# Altium schematic sheet Ports.SchDoc
size 420 x 297 mm; SheetNumber: 13; SheetTotal: 13
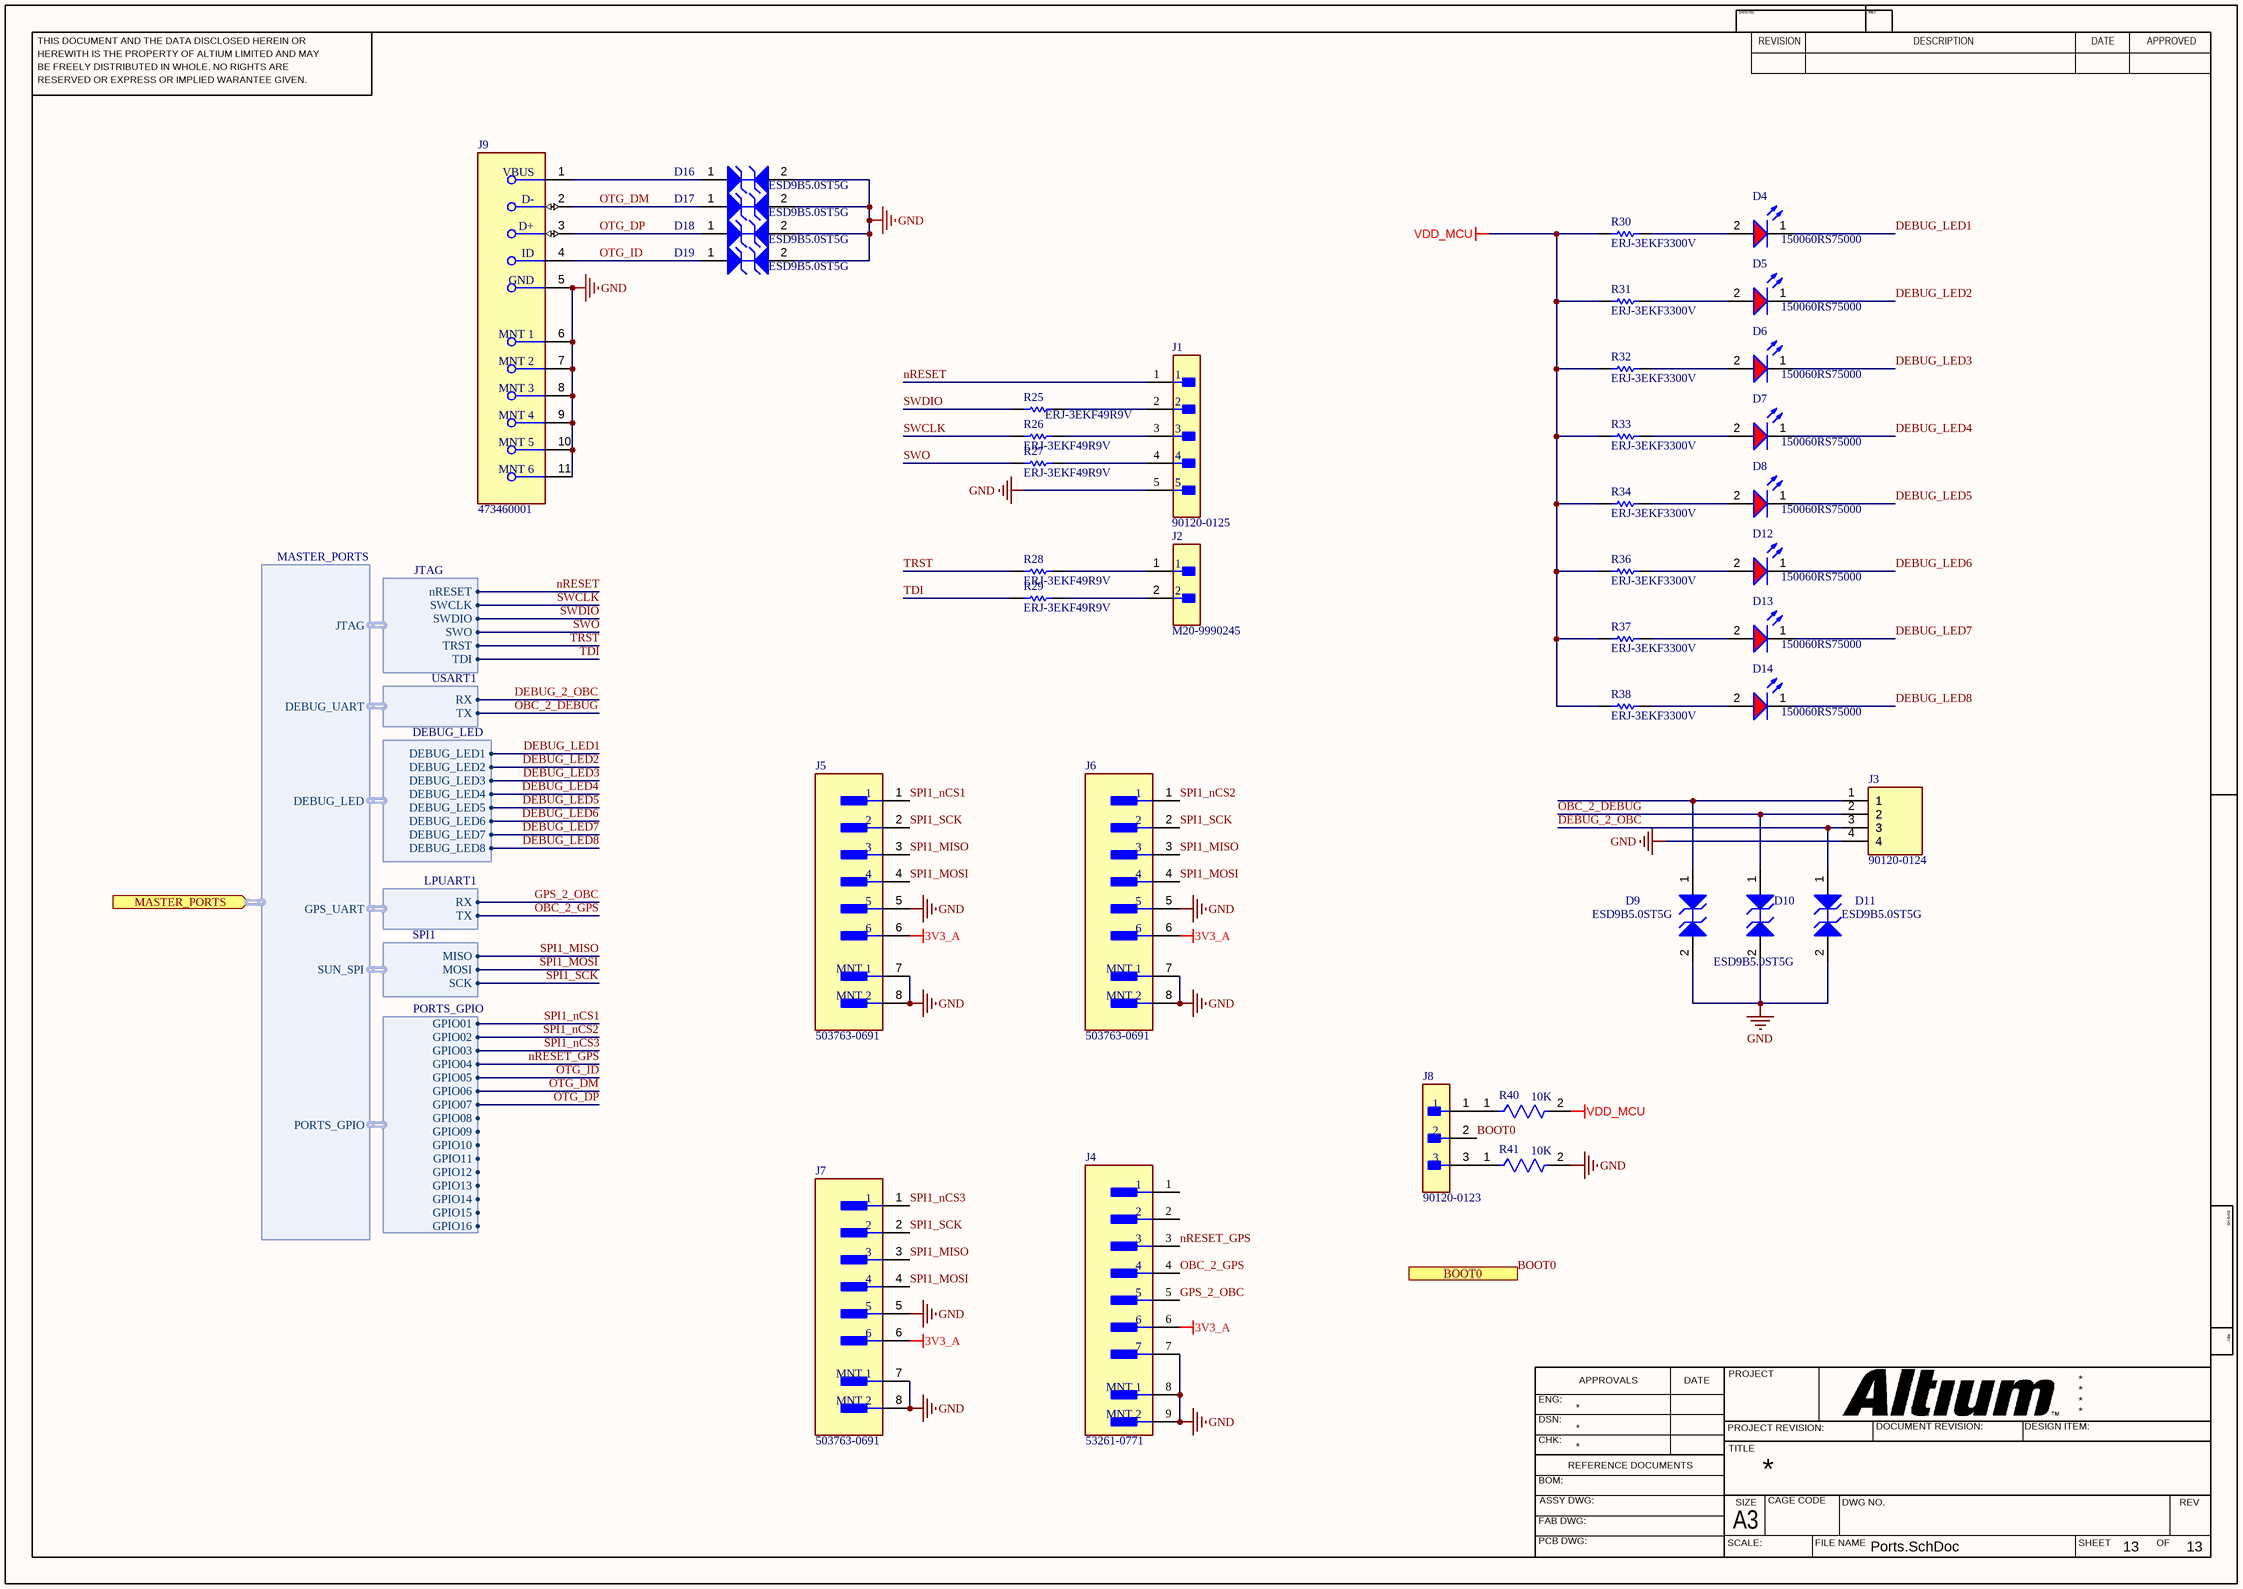
[diagram p0: Ports.SchDoc]

## Parts
D4  150060RS75000  [WL-SMCW_0603_150060xx75000]
D5  150060RS75000  [WL-SMCW_0603_150060xx75000]
D6  150060RS75000  [WL-SMCW_0603_150060xx75000]
D7  150060RS75000  [WL-SMCW_0603_150060xx75000]
D8  150060RS75000  [WL-SMCW_0603_150060xx75000]
D9  ESD9B5.0ST5G  [ONSC-SOD-923-2-514AB-01_V]
D10  ESD9B5.0ST5G  [ONSC-SOD-923-2-514AB-01_V]
D11  ESD9B5.0ST5G  [ONSC-SOD-923-2-514AB-01_V]
D12  150060RS75000  [WL-SMCW_0603_150060xx75000]
D13  150060RS75000  [WL-SMCW_0603_150060xx75000]
D14  150060RS75000  [WL-SMCW_0603_150060xx75000]
D16  ESD9B5.0ST5G  [ONSC-SOD-923-2-514AB-01_V]
D17  ESD9B5.0ST5G  [ONSC-SOD-923-2-514AB-01_V]
D18  ESD9B5.0ST5G  [ONSC-SOD-923-2-514AB-01_V]
D19  ESD9B5.0ST5G  [ONSC-SOD-923-2-514AB-01_V]
J1  90120-0125  [FP-90120-0125-MFG]
J2  M20-9990245  [FP-M20-9990245-MFG]
J3  90120-0124  [HDRV4W65P0X254_1X4_1016X254X945P]
J4  53261-0771  [FP-53261-0771-MFG]
J5  503763-0691  [FP-503763-0691-MFG]
J6  503763-0691  [FP-503763-0691-MFG]
J7  503763-0691  [FP-503763-0691-MFG]
J8  90120-0123  [FP-90120-0123-MFG]
J9  473460001  [FP-473460001-MFG]
R25  ERJ-3EKF49R9V  [RESC1608X55X30ML15T15]
R26  ERJ-3EKF49R9V  [RESC1608X55X30ML15T15]
R27  ERJ-3EKF49R9V  [RESC1608X55X30ML15T15]
R28  ERJ-3EKF49R9V  [RESC1608X55X30ML15T15]
R29  ERJ-3EKF49R9V  [RESC1608X55X30ML15T15]
R30  ERJ-3EKF3300V  [RESC1608X55X30LL15T15]
R31  ERJ-3EKF3300V  [RESC1608X55X30LL15T15]
R32  ERJ-3EKF3300V  [RESC1608X55X30LL15T15]
R33  ERJ-3EKF3300V  [RESC1608X55X30LL15T15]
R34  ERJ-3EKF3300V  [RESC1608X55X30LL15T15]
R36  ERJ-3EKF3300V  [RESC1608X55X30LL15T15]
R37  ERJ-3EKF3300V  [RESC1608X55X30LL15T15]
R38  ERJ-3EKF3300V  [RESC1608X55X30LL15T15]
R40  10K  [FP-RK73B1J-MFG]
R41  10K  [FP-RK73B1J-MFG]

## Ports
BOOT0 (in), MASTER_PORTS (in, harness MASTER_PORTS)

## Harnesses
MASTER_PORTS: JTAG, DEBUG_UART, DEBUG_LED, GPS_UART, SUN_SPI, PORTS_GPIO
JTAG: nRESET, SWCLK, SWDIO, SWO, TDI, TRST
USART1: TX, RX
DEBUG_LED: DEBUG_LED1, DEBUG_LED2, DEBUG_LED3, DEBUG_LED4, DEBUG_LED5, DEBUG_LED6, DEBUG_LED7, DEBUG_LED8
LPUART1: TX, RX
SPI1: MOSI, MISO, SCK
PORTS_GPIO: GPIO01, GPIO02, GPIO03, GPIO04, GPIO05, GPIO06, GPIO07, GPIO08, GPIO09, GPIO10, GPIO11, GPIO12, GPIO13, GPIO14, GPIO15, GPIO16

## Nets
3V3_A: J4.6 J5.6 J6.6 J7.6
GND: D9.2(A2) D10.2(A2) D11.2(A2) D16.2(A2) D17.2(A2) D18.2(A2) D19.2(A2) J1.5 J3.4 J4.7 J4.8(MNT_1) J4.9(MNT_2) J5.5 J5.7(MNT_1) J5.8(MNT_2) J6.5 J6.7(MNT_1) J6.8(MNT_2) J7.5 J7.7(MNT_1) J7.8(MNT_2) J9.5(GND) J9.6(MNT_1) J9.7(MNT_2) J9.8(MNT_3) J9.9(MNT_4) J9.10(MNT_5) J9.11(MNT_6) R41.2
VDD_MCU: R30.1 R31.1 R32.1 R33.1 R34.1 R36.1 R37.1 R38.1 R40.2
BOOT0: J8.2 ; port BOOT0
DEBUG_2_OBC: D11.1(A1) J3.3 ; harness USART1.RX
DEBUG_LED1: D4.1(K) ; harness DEBUG_LED.DEBUG_LED1
DEBUG_LED2: D5.1(K) ; harness DEBUG_LED.DEBUG_LED2
DEBUG_LED3: D6.1(K) ; harness DEBUG_LED.DEBUG_LED3
DEBUG_LED4: D7.1(K) ; harness DEBUG_LED.DEBUG_LED4
DEBUG_LED5: D8.1(K) ; harness DEBUG_LED.DEBUG_LED5
DEBUG_LED6: D12.1(K) ; harness DEBUG_LED.DEBUG_LED6
DEBUG_LED7: D13.1(K) ; harness DEBUG_LED.DEBUG_LED7
DEBUG_LED8: D14.1(K) ; harness DEBUG_LED.DEBUG_LED8
GPS_2_OBC: J4.5 ; harness LPUART1.RX
nRESET: J1.1 ; harness JTAG.nRESET
nRESET_GPS: J4.3 ; harness PORTS_GPIO.GPIO04
OBC_2_DEBUG: D10.1(A1) J3.2 ; harness USART1.TX
OBC_2_GPS: J4.4 ; harness LPUART1.TX
OTG_DM: D17.1(A1) J9.2(D-) ; harness PORTS_GPIO.GPIO06
OTG_DP: D18.1(A1) J9.3(D+) ; harness PORTS_GPIO.GPIO07
OTG_ID: D19.1(A1) J9.4(ID) ; harness PORTS_GPIO.GPIO05
SPI1_MISO: J5.3 J6.3 J7.3 ; harness SPI1.MISO
SPI1_MOSI: J5.4 J6.4 J7.4 ; harness SPI1.MOSI
SPI1_nCS1: J5.1 ; harness PORTS_GPIO.GPIO01
SPI1_nCS2: J6.1 ; harness PORTS_GPIO.GPIO02
SPI1_nCS3: J7.1 ; harness PORTS_GPIO.GPIO03
SPI1_SCK: J5.2 J6.2 J7.2 ; harness SPI1.SCK
SWCLK: R26.1 ; harness JTAG.SWCLK
SWDIO: R25.1 ; harness JTAG.SWDIO
SWO: R27.1 ; harness JTAG.SWO
TDI: R29.1 ; harness JTAG.TDI
TRST: R28.1 ; harness JTAG.TRST
NetD4_2: D4.2(A) R30.2
NetD5_2: D5.2(A) R31.2
NetD6_2: D6.2(A) R32.2
NetD7_2: D7.2(A) R33.2
NetD8_2: D8.2(A) R34.2
NetD9_1: D9.1(A1) J3.1
NetD12_2: D12.2(A) R36.2
NetD13_2: D13.2(A) R37.2
NetD14_2: D14.2(A) R38.2
NetD16_1: D16.1(A1) J9.1(VBUS)
NetJ1_2: J1.2 R25.2
NetJ1_3: J1.3 R26.2
NetJ1_4: J1.4 R27.2
NetJ2_1: J2.1 R28.2
NetJ2_2: J2.2 R29.2
NetJ8_1: J8.1 R40.1
NetJ8_3: J8.3 R41.1

Not connected (* = marked no-connect by the designer): J4 1 2

## Notes on the sheet
- THIS DOCUMENT AND THE DATA DISCLOSED HEREIN OR
- HEREWITH IS THE PROPERTY OF ALTIUM LIMITED AND MAY
- DWG NO:
- REVISION
- REV:
- DESCRIPTION
- DATE
- APPROVED
- BE FREELY DISTRIBUTED IN WHOLE. NO RIGHTS ARE
- RESERVED OR EXPRESS OR IMPLIED WARANTEE GIVEN.
- ENG:
- APPROVALS
- PROJECT
- DSN:
- CHK:
- REFERENCE DOCUMENTS
- PROJECT REVISION:
- TITLE
- DOCUMENT REVISION:
- DESIGN ITEM:
- BOM:
- FAB DWG:
- PCB DWG:
- ASSY DWG:
- SCALE:
- A3
- SIZE
- CAGE CODE
- FILE NAME
- DWG NO.
- SHEET
- OF
- REV

## Library data of the parts
D4-D8 D12-D14 = CMP-1426-00001-4: LED Low-Power Uni-Color Red 630nm 2V 2-Pin Chip 0603(1608Metric) T/R; Max Junction Temperature (Tj): 95°C; Dominant Wavelength: 625nm; Lens Style: Clear, Rectangular; Viewing Angle: 140°; Forward Current: 100mA; Max Reverse Voltage (DC): 5V; Luminous Intensity: 250mcd; Test Current: 20mA; Power Dissipation: 72mW; Max Operating Temperature: 85°C; Mount: Surface Mount; Height: 700µm; Packaging: Tape and Reel; REACH SVHC: Unknown; Case Code (Metric): 1608; Peak Wavelength: 630nm; Forward Voltage: 2V; Case/Package: 0603; Color: Red; RoHS: Compliant; Width: 800µm; Reverse Voltage: 5V; Min Operating Temperature: -40°C; Wavelength: 625nm; Case Code (Imperial): 0603; Length: 1.6mm
D9-D11 D16-D19 = CMP-1063-00119-1: Transient Voltage Suppressor, Micro-Packaged Diode for ESD Protection, 2-Pin SOD-923, Pb-Free, Tape and Reel; Manufacturer: On Semiconductor; Number of Lines: 1; Direction: Bidirectional; V(BR) Min (V): 5.8; VRWM Max (V): 5; Packing: Tape and Reel; PackageDescription: 2-Pin SOD, Body 0.8 x 0.6 mm; IR Max (uA): 1; ComponentLink3Description: Package Specification; PartNumber: ESD9B5.0ST5G; ComponentLink1URL: http://www.onsemi.com/; RoHS: Pb-Free; Mounting Technology: Surface Mount; DatasheetVersion: Rev. 2; ComponentLink2URL: http://www.onsemi.cn/pub_link/Collateral/ESD9B-D.PDF; ComponentLink3URL: http://www.onsemi.com/pub_link/Collateral/514AB.PDF; PackageReference: SOD-923-2-514AB-01; PackageVersion: Rev. C, 03/2011; ComponentLink1Description: Manufacturer URL; ComponentLink2Description: Datasheet
J1 = CMP-00257-00655425-1: 90120-0125 2.54mm Pitch C-Grid III Header, Single Row, Vertical, 5 Circuits, Tin (Sn) Plating; NexarPartId: 655425; Manufacturer Lifecycle Status: ACTIVE; Lead Length: 2.9mm; Number of Positions: 5; Current Rating: 3A; Mating Post Length: 6.75mm; Glow Wire Compliant: Non-compliant; Contact Resistance: 20mΩ; Voltage Rating: 350V; Gender: Male; Max Voltage Rating (DC): 350.35kV; Max Operating Temperature: 125°C; Number of Pins: 5; Plating: Tin; Contact Material: Brass; Mount: Through Hole; Contact Gender: Male; Packaging: Bulk; Schedule B: 8536694040; Lifecycle Status: Production; Lead Pitch: 2.54mm; Radiation Hardening: No; Orientation: Vertical; Min Operating Temperature: -55°C; Country of Origin: SK; Housing Color: Black; REACH SVHC: No SVHC; Contact Plating: Tin; Number of Rows: 1; Number of Circuits: 5; Termination: Solder; Number of Contacts: 5; Pitch: 2.54mm; Housing Material: Polyester; RoHS: Compliant; Lead Free: Lead Free; Voltage Rating (AC): 350V
J2 = CMP-15831-000105-1: CONN HEADER VERT 2POS 2.54MM; Working Voltage: 750V; Gender: Male; Number of Poles: 2; Current Rating: 3A; Mated Stacking Heights: 16.54mm; Contact Resistance: 25mR; Connector Type: Male Pin; Insulation Resistance: 10GR; Mating Cycles: 300; Voltage: 50V; Flammability Rating: UL94 V-0; Pitch: 2.54mm; Series: M20; Number of Contacts: 2; Height: 0.12inch; Min Operating Temperature: -40°C; Contact Finish - Mating: GOLD; Number of Positions: 2; Number of Rows: 1; Packaging: Bulk; Package Quantity: 1000; Voltage Rating (AC): 750V; Current: 3A; Mount: Through Hole; Case/Package: SIL; Orientation: Straight; Contact Shape: Square; Weight: 0.25lb; Radiation Hardening: No; Fastening Type: Pull; Length: 5.08mm; Depth: 2.54mm; Contact Mating Length: 0.24inch; Housing Material: Nylon; Reach SVHC Compliant: Yes; Insulation Material: Nylon; Color: Black; Width: 0.25inch; Insulation Color: Black; Contact Material: Brass; Contact Type: Male Pin; Termination: Solder; Max Operating Temperature: 105°C; Contact Plating: Gold; Housing Color: Black; Max Current Rating: 3A; Lead Pitch: 2.54mm
J3 = 90120-0124: Connector; Manufacturer_Name: Molex; Datasheet Link: https://componentsearchengine.com/Datasheets/2/90120-0124.pdf; Height: 9.45mm; Manufacturer_Part_Number: 90120-0124; Mouser Part Number: 538-90120-0124; Mouser Price/Stock: https://www.mouser.co.uk/ProductDetail/Molex/90120-0124?qs=PvP5v7EimsmprSEogp1JLQ%3D%3D
J4 = CMP-04776-000278-1: CONN HEADER SMD R/A 7POS 1.25MM; Voltage Rating (AC): 125V; Number of Contacts: 7; Connector Type: Blade Pin; Body Plating: Tin; Insulation Resistance: 100MR; Current Rating: 1A; Contact Resistance: 20mR; Min Operating Temperature: -40°C; Contact Gender: Male; Contact Material: Bronze; Number of Positions: 7; Radiation Hardening: No; Packaging: Tape and Reel; Pitch: 1.25mm; Flammability Rating: UL94 V-0; Orientation: Right Angle; Color: Natural; Number of Rows: 1; Series: PicoBlade; Length: 13.9mm; Lead Pitch: 1.25mm; Contact Type: Blade Pin; Mount: Surface Mount; Depth: 5.2mm; Housing Material: Nylon; Contact Plating: Tin; Working Voltage: 125V; Max Operating Temperature: 85°C; Voltage Rating: 125V; RoHS Compliant: Yes; Housing Color: Natural; Termination: Solder
J5-J7 = CMP-04776-000530-1: CONN HEADER SMD R/A 6POS 1MM
J8 = CMP-04776-000237-1: CONN HEADER VERT 3POS 2.54MM; Number of Circuits: 3; Max Voltage Rating (DC): 350.35kV; Contact Resistance: 20mR; Gender: Male; Voltage Rating (AC): 350V; Glow Wire Compliant: Non-compliant; Current Rating: 3A; Contact Post Length: 2.9mm; Number of Contacts: 3; Number of Rows: 1; Max Operating Temperature: 125°C; Orientation: Vertical; Number of Positions: 3; Packaging: Tray; Contact Mating Length: 6.75mm; Housing Color: Black; Termination: Solder; Contact Material: Brass; Radiation Hardening: No; Lead Free: Lead Free; Pitch: 2.54mm; RoHS Compliant: Yes; Voltage Rating: 350V; Contact Plating: Tin; Color: Black; Min Operating Temperature: -55°C; Mount: Through Hole; Housing Material: Polyester; Series: 90120; Contact Gender: Male; REACH SVHC: No SVHC
J9 = CMP-2000-05246-2: CONN RCPT USB2.0 MICRO B SMD R/A; Manufacturer: Molex; Conn Orientation: Right Angle; Is Female: yes; Shielding: true; Pitch: 0.65mm; Number Of Contacts: 5; Voltage Rating: 30V; Current Rating: 1.8A; Device Class L2: USB Connectors; Digikey Description: CONN RCPT USB2.0 MICRO B SMD R/A; Height: 2.945mm; RoHS: TRUE; ComponentLink2Description: Datasheet; Octopart: https://octopart.com/47346-0001-molex-7164928; Automotive: No; Package: 0; Category: Conn; Device Class L1: Connectors; Usb Standard: USB 2.0; Temperature: -30°C to +85°C; Temperature Range Low: -30°C; Footprint Url: https://www.molex.com/pdm_docs/sd/473460001_sd.pdf; ComponentLink2URL: https://www.molex.com/webdocs/datasheets/pdf/en-us/0473460001_IO_CONNECTORS.pdf; Lead Free: Yes; Manufacturer Part Number: 473460001; Contact Material: Gold,Nickel; Temperature Range High: +85°C; Device Class L3: unset
R25-R29 = CMP-2000-00538-1: Manufacturer: Panasonic; Part Number: ERJ-3EKF49R9V
R30-R34 R36-R38 = CMP-2000-00435-2: Chip Resistor, 330 Ohm, +/- 1%, 0.1 W, -55 to 155 degC, 0603 (1608 Metric), RoHS, Tape and Reel; Gender: Male; Mating Cycles: 10000; Current Rating: 500 mA; Voltage Rating: 10 V; REACH SVHC: No SVHC; PackageDescription: 2-Pin Surface Mount Device, Body 1.6 x 0.85 mm; Contact Finish: Gold; Pins: 8; ComponentLink1Description: Manufacturer URL; Packaging: Tape and Reel; Max Operating Temperature: 85 degC; Contact Material: Copper; Height: 1.45 mm; Width: 1.45 mm; DatasheetVersion: Apr-15; Package Quantity: 1500; Contact Plating: Gold; PackageReference: 0603; Mount: Surface Mount; Lead Pitch: 1.1 mm; Min Operating Temperature: -25 degC; ComponentLink1URL: http://www.panasonic.com/; ComponentLink2URL: http://industrial.panasonic.com/cdbs/www-data/pdf/RDA0000/AOA0000C86.pdf; Length: 13.7 mm; ComponentLink2Description: Datasheet; RoHSCompliant: true
R40 R41 = CMP-2000-01851-2: RES 10K OHM 5% 1/10W 0603; Temperature Coefficient: 200ppm/°C; Voltage Rating: 50V; Power Rating: 100mW; Resistance: 10kR; Length: 1.6mm; Lead Free: Lead Free; Resistance Tolerance: 5%; Case Code (Metric): 1608; Width: 0.8mm; Height: 0.45mm; Max Operating Temperature: 155°C; RoHS Compliant: Yes; Resistor Type: Thick Film; Min Operating Temperature: -55°C; Case Code (Imperial): 0603; Technology: THICK FILM; Package Quantity: 5000; Tolerance: 5%; Case/Package: 0603; Voltage Rating (DC): 50V; Depth: 0.8mm; Packaging: Tape and Reel; Number of Pins: 2; Construction: Rectangular; Series: RK73B; Military Standard: Not; Termination: SMD/SMT